# EAGLE design board (EAGLE 9.3.0)
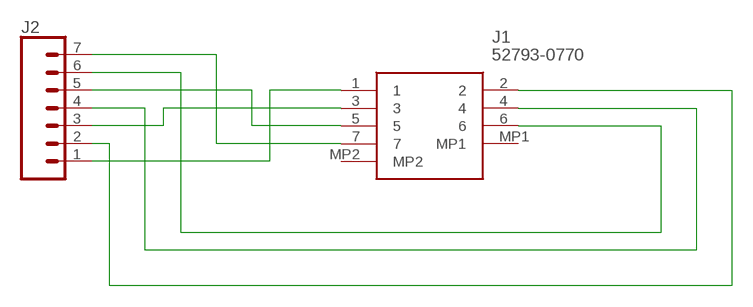
[diagram p0: schematic, sheet 1]

## Parts
J1  52793-0770  [527930770]
J2  CONN_07  [1X07]

## Nets
N$1: J1.1 J2.1
N$2: J1.2 J2.2
N$3: J1.3 J2.3
N$4: J1.4 J2.4
N$5: J1.5 J2.5
N$6: J1.6 J2.6
N$7: J1.7 J2.7
Unconnected: J1.MP1 J1.MP2

## Library data of the parts
J1 = 52793-0770:52793-0770: FFC & FPC Connectors 1.0 FFC Non ZIF HsgA ssySMT 7CktEmbsTpPkg Source: Datasheet <https://www.molex.com/pdm_docs/sd/527930770_sd.pdf>; ALLIED_NUMBER: 71463733; ALLIED_PRICE-STOCK: https://www.alliedelec.com/molex-incorporated-52793-0770/71463733/; DESCRIPTION: FFC & FPC Connectors 1.0 FFC Non ZIF HsgA ssySMT 7CktEmbsTpPkg; HEIGHT: 3.4mm; MANUFACTURER_NAME: Molex; MANUFACTURER_PART_NUMBER: 52793-0770; MOUSER_PART_NUMBER: 538-52793-0770; MOUSER_PRICE-STOCK: https://www.mouser.com/Search/Refine.aspx?Keyword=538-52793-0770
J2 = SparkFun-Connectors:CONN_07: Multi connection point. Often used as Generic Header-pin footprint for 0.1 inch spaced/style header connections On any of the 0.1 inch spaced packages, you can populate with these: Break Away Headers - Straight <https://www.sparkfun.com/products/116> (PRT-00116) Break Away Male Headers - Right Angle <https://www.sparkfun.com/products/553> (PRT-00553) Female Headers <https://www.sparkfun.com/products/115> (PRT-00115) Break Away Headers - Machine Pin <https://www.sparkfun.com/products/117> (PRT-00117) Break Away Female Headers - Swiss Machine Pin <https://www.sparkfun.com/products/743> (PRT-00743) For SCREWTERMINALS and SPRING TERMINALS visit here: Screw Terimnals on SparkFun.com <https://www.sparkfun.com/search/results?term=Screw+Terminals> (5mm/3.5mm/2.54mm spacing) This device is also useful as a general connection point to wire up your design to another part of your project. Our various solder wires solder well into these plated through hole pads. Hook-Up Wire - Assortment (Stranded, 22 AWG) <https://www.sparkfun.com/products/11375> (PRT-11375) Hook-Up Wire - Assortment (Solid Core, 22 AWG) <https://www.sparkfun.com/products/11367> (PRT-11367) View the entire wire category on our website here <https://www.sparkfun.com/categories/141> Special notes: Molex polarized connector foot print use with SKU : PRT-08231 with associated crimp pins and housings. 1MM SMD Version SKU: PRT-10208 NOTES ON THE VARIANTS LOCK and LOCK_LONGPADS... This footprint was designed to help hold the alignment of a through-hole component (i.e. 6-pin header) while soldering it into place. You may notice that each hole has been shifted either up or down by 0.005 of an inch from it's more standard position (which is a perfectly straight line). This slight alteration caused the pins (the squares in the middle) to touch the edges of the holes. Because they are alternating, it causes a "brace" to hold the component in place. 0.005 has proven to be the perfect amount of "off-center" position when using our standard breakaway headers. Although looks a little odd when you look at the bare footprint, once you have a header in there, the alteration is very hard to notice. Also,if you push a header all the way into place, it is covered up entirely on the bottom side.

## Net classes
0 default: clearance 0.254 mm

## Board
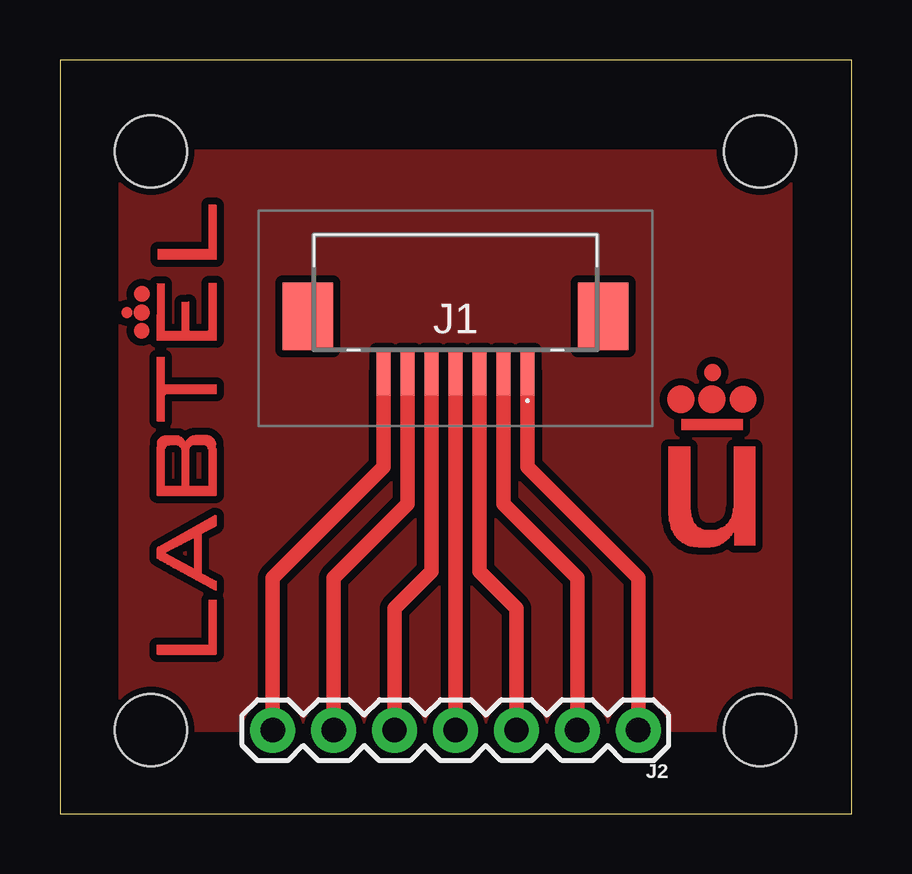
[diagram p1: board, top side]
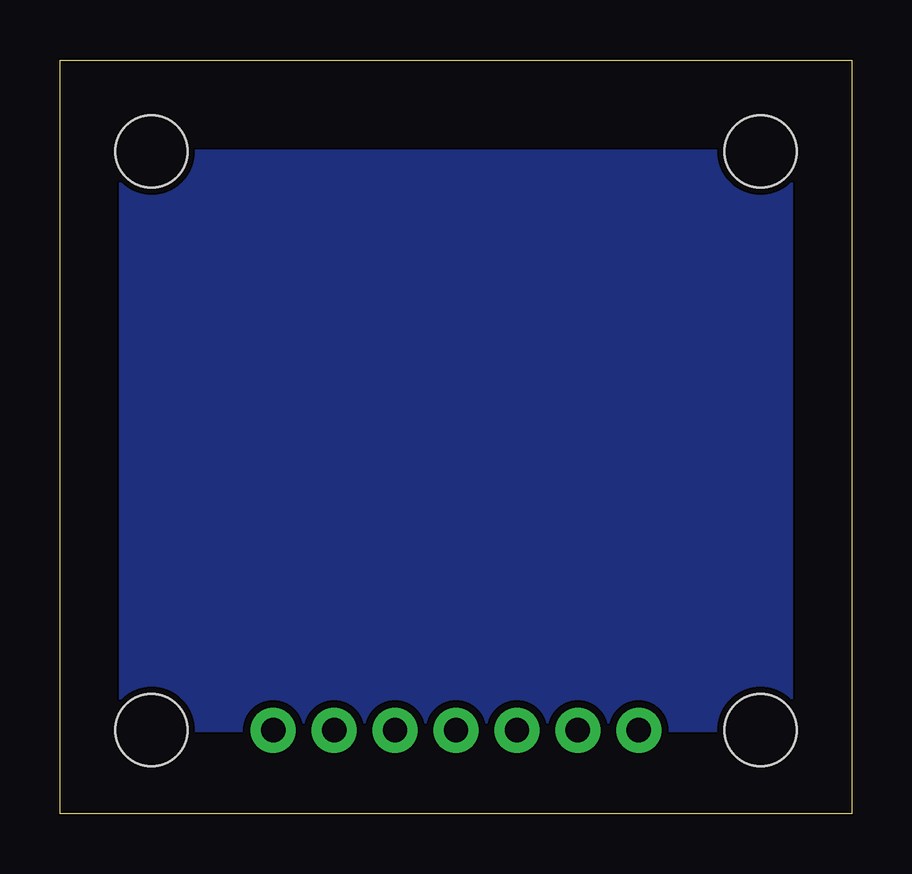
[diagram p2: board, bottom side, seen from below]

Size 33 x 31.42 mm. Coordinates in mm from the lower left corner, seen from the top.
Outline: 33,31.42 0,31.42 0,0 33,0 33,31.42
Copper layers (1*16): Top 0.035mm / dielectric 1.5mm / Bottom 0.035mm
Design rules "Fabricacion_interna_microfresadora": minimum track width 12mil, minimum drill 28mil, track to track 12mil, track to pad 12mil, pad to pad 12mil, via to via 12mil, smd to smd 0mil, copper to edge 12mil, drill to drill 12mil, minimum pad ring 6mil, minimum via ring 6mil, stop-mask expansion 4mil, vias tented up to drill 0mil, thermal gap 12mil
Holes 3 mm at 29.19,3.48 3.79,3.48 3.79,27.61 29.19,27.61

### Footprints (pad centres in the part's own frame; a part is rotated, then mirrored left to right if it is on the bottom)
527930770 = smd 0.6 x 1.9: 1 -3,2.875; 2 -2,2.875; 3 -1,2.875; 4 0,2.875; 5 1,2.875; 6 2,2.875; 7 3,2.875 | smd 2.1 x 2.8: MP1 -6.15,0.525; MP2 6.15,0.525
1X07 = drill 1.016 pad 1.88: 1 0,0; 2 2.54,0; 3 5.08,0; 4 7.62,0; 5 10.16,0; 6 12.7,0; 7 15.24,0

### Placement (x,y rotation side)
J1  16.49,21.26 180 top
J2  24.11,3.48 180 top
U$1  [URJC]  25.38,11.1 0 top
U$2  [LABTEL]  7.6,6.02 90 top

### Tracks (layer width: path | path; a pad name or v marks a point on that pad's centre or on a via)
GND
  pour Top: 2.52,27.61 30.46,27.61 30.46,3.48 2.52,3.48
  pour Bottom: 2.52,27.61 30.46,27.61 30.46,3.48 2.52,3.48
N$1
  Top 0.61: J1.1 19.49,14.45 24.11,9.83 J2.1
N$2
  Top 0.61: J1.2 18.49,12.91 21.57,9.83 J2.2
N$3
  Top 0.61: J1.3 17.49,10.1 19.03,8.56 J2.3
N$4
  Top 0.61: J1.4 J2.4
N$5
  Top 0.61: J1.5 15.49,10.1 13.95,8.56 J2.5
N$6
  Top 0.61: J1.6 14.49,12.91 11.41,9.83 J2.6
N$7
  Top 0.61: J1.7 13.49,14.45 8.87,9.83 J2.7